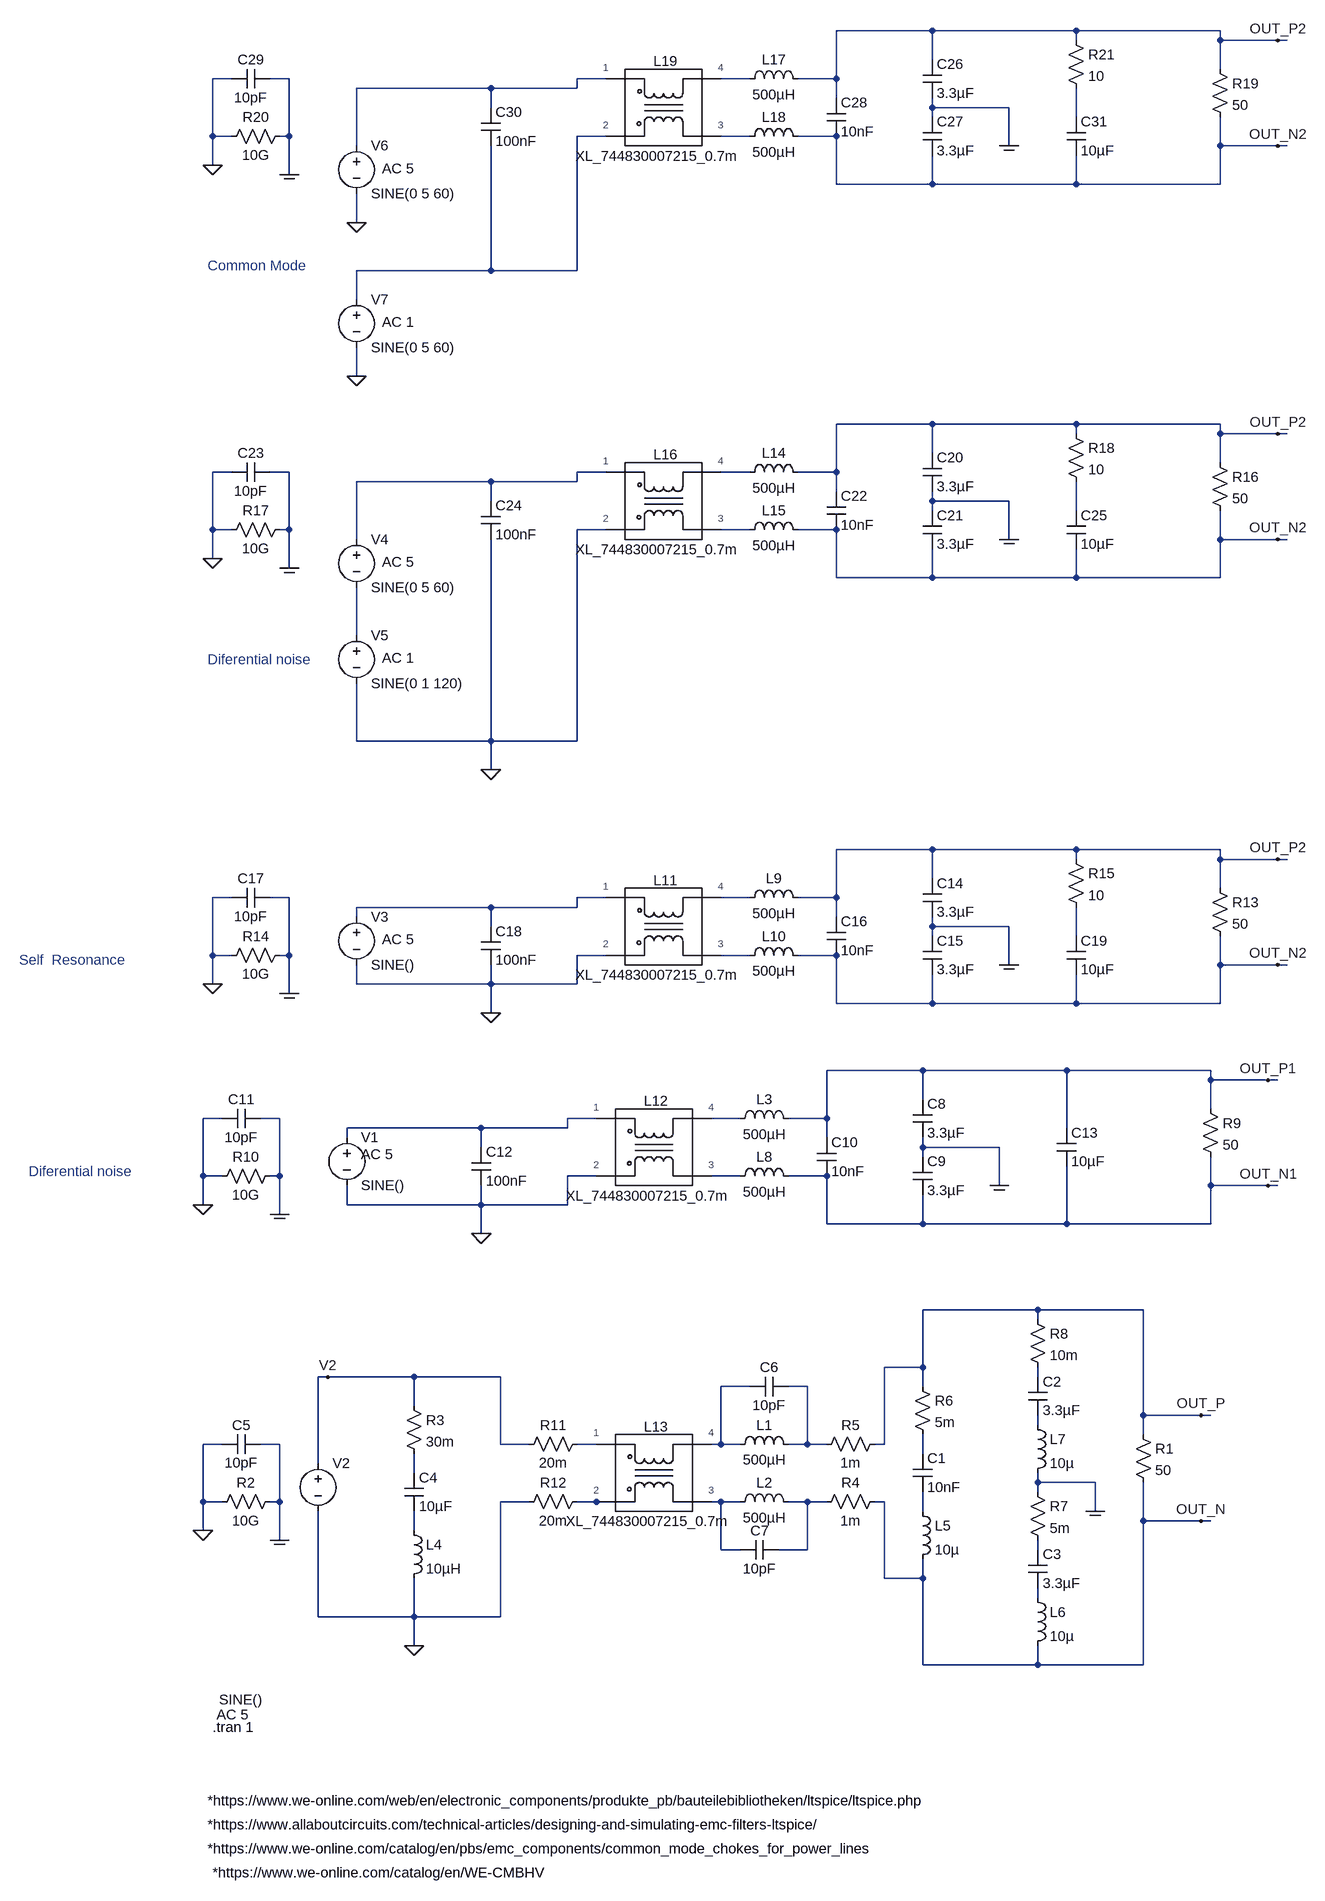
[diagram p0: schematic EMC-Filter_Cut.asc]
EMC-Filter_Cut.asc, the LTspice schematic file:
Version 4
SHEET 1 880 680
WIRE 240 -2928 80 -2928
WIRE 480 -2928 240 -2928
WIRE 720 -2928 480 -2928
WIRE 480 -2912 480 -2928
WIRE 720 -2912 720 -2928
WIRE 816 -2912 720 -2912
WIRE 832 -2912 816 -2912
WIRE 240 -2880 240 -2928
WIRE 720 -2864 720 -2912
WIRE -928 -2848 -960 -2848
WIRE -832 -2848 -864 -2848
WIRE -304 -2848 -352 -2848
WIRE -64 -2848 -112 -2848
WIRE 80 -2848 80 -2928
WIRE 80 -2848 16 -2848
WIRE -496 -2832 -720 -2832
WIRE -352 -2832 -352 -2848
WIRE -352 -2832 -496 -2832
WIRE 80 -2816 80 -2848
WIRE -496 -2800 -496 -2832
WIRE 240 -2800 240 -2816
WIRE 368 -2800 240 -2800
WIRE 240 -2784 240 -2800
WIRE 480 -2784 480 -2832
WIRE -960 -2752 -960 -2848
WIRE -928 -2752 -960 -2752
WIRE -832 -2752 -832 -2848
WIRE -832 -2752 -848 -2752
WIRE -304 -2752 -352 -2752
WIRE -64 -2752 -112 -2752
WIRE 80 -2752 16 -2752
WIRE -720 -2736 -720 -2832
WIRE 368 -2736 368 -2800
WIRE 720 -2736 720 -2784
WIRE 816 -2736 720 -2736
WIRE 832 -2736 816 -2736
WIRE -960 -2704 -960 -2752
WIRE -832 -2688 -832 -2752
WIRE 80 -2672 80 -2752
WIRE 240 -2672 240 -2720
WIRE 240 -2672 80 -2672
WIRE 480 -2672 480 -2720
WIRE 480 -2672 240 -2672
WIRE 720 -2672 720 -2736
WIRE 720 -2672 480 -2672
WIRE -720 -2608 -720 -2656
WIRE -496 -2528 -496 -2736
WIRE -496 -2528 -720 -2528
WIRE -352 -2528 -352 -2752
WIRE -352 -2528 -496 -2528
WIRE -720 -2480 -720 -2528
WIRE -720 -2352 -720 -2400
WIRE 240 -2272 80 -2272
WIRE 480 -2272 240 -2272
WIRE 720 -2272 480 -2272
WIRE 480 -2256 480 -2272
WIRE 720 -2256 720 -2272
WIRE 816 -2256 720 -2256
WIRE 832 -2256 816 -2256
WIRE 240 -2224 240 -2272
WIRE 720 -2208 720 -2256
WIRE -928 -2192 -960 -2192
WIRE -832 -2192 -864 -2192
WIRE -304 -2192 -352 -2192
WIRE -64 -2192 -112 -2192
WIRE 80 -2192 80 -2272
WIRE 80 -2192 16 -2192
WIRE -496 -2176 -720 -2176
WIRE -352 -2176 -352 -2192
WIRE -352 -2176 -496 -2176
WIRE 80 -2160 80 -2192
WIRE -496 -2144 -496 -2176
WIRE 240 -2144 240 -2160
WIRE 368 -2144 240 -2144
WIRE 240 -2128 240 -2144
WIRE 480 -2128 480 -2176
WIRE -960 -2096 -960 -2192
WIRE -928 -2096 -960 -2096
WIRE -832 -2096 -832 -2192
WIRE -832 -2096 -848 -2096
WIRE -304 -2096 -352 -2096
WIRE -64 -2096 -112 -2096
WIRE 80 -2096 16 -2096
WIRE -720 -2080 -720 -2176
WIRE 368 -2080 368 -2144
WIRE 720 -2080 720 -2128
WIRE 816 -2080 720 -2080
WIRE 832 -2080 816 -2080
WIRE -960 -2048 -960 -2096
WIRE -832 -2032 -832 -2096
WIRE 80 -2016 80 -2096
WIRE 240 -2016 240 -2064
WIRE 240 -2016 80 -2016
WIRE 480 -2016 480 -2064
WIRE 480 -2016 240 -2016
WIRE 720 -2016 720 -2080
WIRE 720 -2016 480 -2016
WIRE -720 -1920 -720 -2000
WIRE -720 -1744 -720 -1840
WIRE -496 -1744 -496 -2080
WIRE -496 -1744 -720 -1744
WIRE -352 -1744 -352 -2096
WIRE -352 -1744 -496 -1744
WIRE -496 -1696 -496 -1744
WIRE 240 -1536 80 -1536
WIRE 480 -1536 240 -1536
WIRE 720 -1536 480 -1536
WIRE 480 -1520 480 -1536
WIRE 720 -1520 720 -1536
WIRE 816 -1520 720 -1520
WIRE 832 -1520 816 -1520
WIRE 240 -1488 240 -1536
WIRE 720 -1472 720 -1520
WIRE -928 -1456 -960 -1456
WIRE -832 -1456 -864 -1456
WIRE -304 -1456 -352 -1456
WIRE -64 -1456 -112 -1456
WIRE 80 -1456 80 -1536
WIRE 80 -1456 16 -1456
WIRE -496 -1440 -720 -1440
WIRE -352 -1440 -352 -1456
WIRE -352 -1440 -496 -1440
WIRE -720 -1424 -720 -1440
WIRE 80 -1424 80 -1456
WIRE -496 -1408 -496 -1440
WIRE 240 -1408 240 -1424
WIRE 368 -1408 240 -1408
WIRE 240 -1392 240 -1408
WIRE 480 -1392 480 -1440
WIRE -960 -1360 -960 -1456
WIRE -928 -1360 -960 -1360
WIRE -832 -1360 -832 -1456
WIRE -832 -1360 -848 -1360
WIRE -304 -1360 -352 -1360
WIRE -64 -1360 -112 -1360
WIRE 80 -1360 16 -1360
WIRE 368 -1344 368 -1408
WIRE 720 -1344 720 -1392
WIRE 816 -1344 720 -1344
WIRE 832 -1344 816 -1344
WIRE -960 -1312 -960 -1360
WIRE -720 -1312 -720 -1344
WIRE -496 -1312 -496 -1344
WIRE -496 -1312 -720 -1312
WIRE -352 -1312 -352 -1360
WIRE -352 -1312 -496 -1312
WIRE -832 -1296 -832 -1360
WIRE 80 -1280 80 -1360
WIRE 240 -1280 240 -1328
WIRE 240 -1280 80 -1280
WIRE 480 -1280 480 -1328
WIRE 480 -1280 240 -1280
WIRE 720 -1280 720 -1344
WIRE 720 -1280 480 -1280
WIRE -496 -1264 -496 -1312
WIRE 224 -1168 64 -1168
WIRE 464 -1168 224 -1168
WIRE 704 -1168 464 -1168
WIRE 704 -1152 704 -1168
WIRE 800 -1152 704 -1152
WIRE 816 -1152 800 -1152
WIRE 224 -1120 224 -1168
WIRE 704 -1104 704 -1152
WIRE -944 -1088 -976 -1088
WIRE -848 -1088 -880 -1088
WIRE -320 -1088 -368 -1088
WIRE -80 -1088 -128 -1088
WIRE 64 -1088 64 -1168
WIRE 64 -1088 0 -1088
WIRE -512 -1072 -736 -1072
WIRE -368 -1072 -368 -1088
WIRE -368 -1072 -512 -1072
WIRE 464 -1072 464 -1168
WIRE -736 -1056 -736 -1072
WIRE 64 -1056 64 -1088
WIRE -512 -1040 -512 -1072
WIRE 224 -1040 224 -1056
WIRE 352 -1040 224 -1040
WIRE 224 -1024 224 -1040
WIRE -976 -992 -976 -1088
WIRE -944 -992 -976 -992
WIRE -848 -992 -848 -1088
WIRE -848 -992 -864 -992
WIRE -320 -992 -368 -992
WIRE -80 -992 -128 -992
WIRE 64 -992 0 -992
WIRE 352 -976 352 -1040
WIRE 704 -976 704 -1024
WIRE 800 -976 704 -976
WIRE 816 -976 800 -976
WIRE -976 -944 -976 -992
WIRE -736 -944 -736 -976
WIRE -512 -944 -512 -976
WIRE -512 -944 -736 -944
WIRE -368 -944 -368 -992
WIRE -368 -944 -512 -944
WIRE -848 -928 -848 -992
WIRE 64 -912 64 -992
WIRE 224 -912 224 -960
WIRE 224 -912 64 -912
WIRE 464 -912 464 -1008
WIRE 464 -912 224 -912
WIRE 704 -912 704 -976
WIRE 704 -912 464 -912
WIRE -512 -896 -512 -944
WIRE 416 -544 224 -544
WIRE 592 -544 416 -544
WIRE 416 -528 416 -544
WIRE 224 -448 224 -544
WIRE 224 -448 160 -448
WIRE -768 -432 -784 -432
WIRE -624 -432 -768 -432
WIRE -480 -432 -624 -432
WIRE 416 -432 416 -448
WIRE -64 -416 -112 -416
WIRE 32 -416 0 -416
WIRE 224 -416 224 -448
WIRE -624 -384 -624 -432
WIRE 592 -368 592 -544
WIRE 688 -368 592 -368
WIRE 704 -368 688 -368
WIRE 416 -352 416 -368
WIRE 592 -336 592 -368
WIRE -944 -320 -976 -320
WIRE -848 -320 -880 -320
WIRE -480 -320 -480 -432
WIRE -432 -320 -480 -320
WIRE -320 -320 -352 -320
WIRE -112 -320 -112 -416
WIRE -112 -320 -128 -320
WIRE -80 -320 -112 -320
WIRE 32 -320 32 -416
WIRE 32 -320 0 -320
WIRE 64 -320 32 -320
WIRE 160 -320 160 -448
WIRE 160 -320 144 -320
WIRE 224 -304 224 -336
WIRE -784 -288 -784 -432
WIRE -624 -272 -624 -304
WIRE 416 -256 416 -272
WIRE 512 -256 416 -256
WIRE 416 -240 416 -256
WIRE -976 -224 -976 -320
WIRE -944 -224 -976 -224
WIRE -848 -224 -848 -320
WIRE -848 -224 -864 -224
WIRE -432 -224 -480 -224
WIRE -320 -224 -352 -224
WIRE -304 -224 -320 -224
WIRE -112 -224 -128 -224
WIRE -80 -224 -112 -224
WIRE 32 -224 0 -224
WIRE 64 -224 32 -224
WIRE 160 -224 144 -224
WIRE 224 -208 224 -240
WIRE 512 -208 512 -256
WIRE 592 -192 592 -256
WIRE 688 -192 592 -192
WIRE 704 -192 688 -192
WIRE -976 -176 -976 -224
WIRE -624 -176 -624 -208
WIRE -848 -160 -848 -224
WIRE -112 -144 -112 -224
WIRE -80 -144 -112 -144
WIRE 32 -144 32 -224
WIRE 32 -144 -16 -144
WIRE 416 -144 416 -160
WIRE 160 -96 160 -224
WIRE 224 -96 224 -128
WIRE 224 -96 160 -96
WIRE 416 -64 416 -80
WIRE -784 -32 -784 -208
WIRE -624 -32 -624 -96
WIRE -624 -32 -784 -32
WIRE -480 -32 -480 -224
WIRE -480 -32 -624 -32
WIRE -624 16 -624 -32
WIRE 224 48 224 -96
WIRE 416 48 416 16
WIRE 416 48 224 48
WIRE 592 48 592 -192
WIRE 592 48 416 48
FLAG -624 16 0
FLAG 688 -368 OUT_P
FLAG 688 -192 OUT_N
FLAG -768 -432 V2
FLAG -976 -176 0
FLAG -848 -160 COM
FLAG 512 -208 COM
FLAG -512 -896 0
FLAG 800 -1152 OUT_P1
FLAG 800 -976 OUT_N1
FLAG -976 -944 0
FLAG -848 -928 COM
FLAG 352 -976 COM
FLAG -496 -1264 0
FLAG 816 -1520 OUT_P2
FLAG 816 -1344 OUT_N2
FLAG -960 -1312 0
FLAG -832 -1296 COM
FLAG 368 -1344 COM
FLAG -496 -1696 0
FLAG 816 -2256 OUT_P2
FLAG 816 -2080 OUT_N2
FLAG -960 -2048 0
FLAG -832 -2032 COM
FLAG 368 -2080 COM
FLAG -720 -2352 0
FLAG 816 -2912 OUT_P2
FLAG 816 -2736 OUT_N2
FLAG -960 -2704 0
FLAG -832 -2688 COM
FLAG 368 -2736 COM
FLAG -720 -2608 0
SYMBOL cap 400 -432 R0
SYMATTR InstName C2
SYMATTR Value 3.3µF
SYMBOL cap 400 -144 R0
SYMATTR InstName C3
SYMATTR Value 3.3µF
SYMBOL voltage -784 -304 R0
WINDOW 3 -165 410 Left 2
WINDOW 123 -169 435 Left 2
WINDOW 39 0 0 Left 0
SYMATTR Value SINE()
SYMATTR Value2 AC 5
SYMATTR InstName V2
SYMBOL res 576 -352 R0
SYMATTR InstName R1
SYMATTR Value 50
SYMBOL cap 208 -304 R0
SYMATTR InstName C1
SYMATTR Value 10nF
SYMBOL res -848 -240 R90
WINDOW 0 0 56 VBottom 2
WINDOW 3 32 56 VTop 2
SYMATTR InstName R2
SYMATTR Value 10G
SYMBOL cap -880 -336 R90
WINDOW 0 0 32 VBottom 2
WINDOW 3 32 32 VTop 2
SYMATTR InstName C5
SYMATTR Value 10pF
SYMBOL cap -640 -272 R0
SYMATTR InstName C4
SYMATTR Value 10µF
SYMBOL ind -96 -304 R270
WINDOW 0 32 56 VTop 2
WINDOW 3 5 56 VBottom 2
SYMATTR InstName L1
SYMATTR Value 500µH
SYMBOL ind -96 -208 R270
WINDOW 0 32 56 VTop 2
WINDOW 3 5 56 VBottom 2
SYMATTR InstName L2
SYMATTR Value 500µH
SYMBOL res -640 -400 R0
SYMATTR InstName R3
SYMATTR Value 30m
SYMBOL ind -640 -192 R0
SYMATTR InstName L4
SYMATTR Value 10µH
SYMBOL res 160 -240 R90
WINDOW 0 0 56 VBottom 2
WINDOW 3 32 56 VTop 2
SYMATTR InstName R4
SYMATTR Value 1m
SYMBOL res 160 -336 R90
WINDOW 0 0 56 VBottom 2
WINDOW 3 32 56 VTop 2
SYMATTR InstName R5
SYMATTR Value 1m
SYMBOL cap 0 -432 R90
WINDOW 0 0 32 VBottom 2
WINDOW 3 32 32 VTop 2
SYMATTR InstName C6
SYMATTR Value 10pF
SYMBOL cap -16 -160 R90
WINDOW 0 0 32 VBottom 2
WINDOW 3 32 32 VTop 2
SYMATTR InstName C7
SYMATTR Value 10pF
SYMBOL res 208 -432 R0
SYMATTR InstName R6
SYMATTR Value 5m
SYMBOL ind 208 -224 R0
SYMATTR InstName L5
SYMATTR Value 10µ
SYMBOL res 400 -256 R0
SYMATTR InstName R7
SYMATTR Value 5m
SYMBOL ind 400 -80 R0
SYMATTR InstName L6
SYMATTR Value 10µ
SYMBOL ind 400 -368 R0
SYMATTR InstName L7
SYMATTR Value 10µ
SYMBOL res 400 -544 R0
SYMATTR InstName R8
SYMATTR Value 10m
SYMBOL cap 208 -1120 R0
SYMATTR InstName C8
SYMATTR Value 3.3µF
SYMBOL cap 208 -1024 R0
SYMATTR InstName C9
SYMATTR Value 3.3µF
SYMBOL res 688 -1120 R0
SYMATTR InstName R9
SYMATTR Value 50
SYMBOL cap 48 -1056 R0
SYMATTR InstName C10
SYMATTR Value 10nF
SYMBOL res -848 -1008 R90
WINDOW 0 0 56 VBottom 2
WINDOW 3 32 56 VTop 2
SYMATTR InstName R10
SYMATTR Value 10G
SYMBOL cap -880 -1104 R90
WINDOW 0 0 32 VBottom 2
WINDOW 3 32 32 VTop 2
SYMATTR InstName C11
SYMATTR Value 10pF
SYMBOL cap -528 -1040 R0
SYMATTR InstName C12
SYMATTR Value 100nF
SYMBOL ind -96 -1072 R270
WINDOW 0 32 56 VTop 2
WINDOW 3 5 56 VBottom 2
SYMATTR InstName L3
SYMATTR Value 500µH
SYMBOL ind -96 -976 R270
WINDOW 0 32 56 VTop 2
WINDOW 3 5 56 VBottom 2
SYMATTR InstName L8
SYMATTR Value 500µH
SYMBOL voltage -736 -1072 R0
WINDOW 123 24 44 Left 2
WINDOW 39 0 0 Left 0
SYMATTR Value2 AC 5
SYMATTR InstName V1
SYMATTR Value SINE()
SYMBOL res -336 -336 R90
WINDOW 0 0 56 VBottom 2
WINDOW 3 32 56 VTop 2
SYMATTR InstName R11
SYMATTR Value 20m
SYMBOL res -336 -240 R90
WINDOW 0 0 56 VBottom 2
WINDOW 3 32 56 VTop 2
SYMATTR InstName R12
SYMATTR Value 20m
SYMBOL cap 448 -1072 R0
SYMATTR InstName C13
SYMATTR Value 10µF
SYMBOL cap 224 -1488 R0
SYMATTR InstName C14
SYMATTR Value 3.3µF
SYMBOL cap 224 -1392 R0
SYMATTR InstName C15
SYMATTR Value 3.3µF
SYMBOL res 704 -1488 R0
SYMATTR InstName R13
SYMATTR Value 50
SYMBOL cap 64 -1424 R0
SYMATTR InstName C16
SYMATTR Value 10nF
SYMBOL res -832 -1376 R90
WINDOW 0 0 56 VBottom 2
WINDOW 3 32 56 VTop 2
SYMATTR InstName R14
SYMATTR Value 10G
SYMBOL cap -864 -1472 R90
WINDOW 0 0 32 VBottom 2
WINDOW 3 32 32 VTop 2
SYMATTR InstName C17
SYMATTR Value 10pF
SYMBOL cap -512 -1408 R0
SYMATTR InstName C18
SYMATTR Value 100nF
SYMBOL ind -80 -1440 R270
WINDOW 0 32 56 VTop 2
WINDOW 3 5 56 VBottom 2
SYMATTR InstName L9
SYMATTR Value 500µH
SYMBOL ind -80 -1344 R270
WINDOW 0 32 56 VTop 2
WINDOW 3 5 56 VBottom 2
SYMATTR InstName L10
SYMATTR Value 500µH
SYMBOL voltage -720 -1440 R0
WINDOW 123 43 54 Left 2
WINDOW 39 0 0 Left 0
SYMATTR Value2 AC 5
SYMATTR InstName V3
SYMATTR Value SINE()
SYMBOL cap 464 -1392 R0
SYMATTR InstName C19
SYMATTR Value 10µF
SYMBOL res 464 -1536 R0
SYMATTR InstName R15
SYMATTR Value 10
SYMBOL MyFiles\\WE-CMBHV -208 -1408 R0
SYMATTR InstName L11
SYMBOL MyFiles\\WE-CMBHV -224 -1040 R0
SYMATTR InstName L12
SYMBOL MyFiles\\WE-CMBHV -224 -272 R0
SYMATTR InstName L13
SYMBOL cap 224 -2224 R0
SYMATTR InstName C20
SYMATTR Value 3.3µF
SYMBOL cap 224 -2128 R0
SYMATTR InstName C21
SYMATTR Value 3.3µF
SYMBOL res 704 -2224 R0
SYMATTR InstName R16
SYMATTR Value 50
SYMBOL cap 64 -2160 R0
SYMATTR InstName C22
SYMATTR Value 10nF
SYMBOL res -832 -2112 R90
WINDOW 0 0 56 VBottom 2
WINDOW 3 32 56 VTop 2
SYMATTR InstName R17
SYMATTR Value 10G
SYMBOL cap -864 -2208 R90
WINDOW 0 0 32 VBottom 2
WINDOW 3 32 32 VTop 2
SYMATTR InstName C23
SYMATTR Value 10pF
SYMBOL cap -512 -2144 R0
SYMATTR InstName C24
SYMATTR Value 100nF
SYMBOL ind -80 -2176 R270
WINDOW 0 32 56 VTop 2
WINDOW 3 5 56 VBottom 2
SYMATTR InstName L14
SYMATTR Value 500µH
SYMBOL ind -80 -2080 R270
WINDOW 0 32 56 VTop 2
WINDOW 3 5 56 VBottom 2
SYMATTR InstName L15
SYMATTR Value 500µH
SYMBOL voltage -720 -2096 R0
WINDOW 123 43 54 Left 2
WINDOW 39 0 0 Left 0
SYMATTR Value2 AC 5
SYMATTR InstName V4
SYMATTR Value SINE(0 5 60)
SYMBOL cap 464 -2128 R0
SYMATTR InstName C25
SYMATTR Value 10µF
SYMBOL res 464 -2272 R0
SYMATTR InstName R18
SYMATTR Value 10
SYMBOL MyFiles\\WE-CMBHV -208 -2144 R0
SYMATTR InstName L16
SYMBOL voltage -720 -1936 R0
WINDOW 123 43 54 Left 2
WINDOW 39 0 0 Left 0
SYMATTR Value2 AC 1
SYMATTR InstName V5
SYMATTR Value SINE(0 1 120)
SYMBOL cap 224 -2880 R0
SYMATTR InstName C26
SYMATTR Value 3.3µF
SYMBOL cap 224 -2784 R0
SYMATTR InstName C27
SYMATTR Value 3.3µF
SYMBOL res 704 -2880 R0
SYMATTR InstName R19
SYMATTR Value 50
SYMBOL cap 64 -2816 R0
SYMATTR InstName C28
SYMATTR Value 10nF
SYMBOL res -832 -2768 R90
WINDOW 0 0 56 VBottom 2
WINDOW 3 32 56 VTop 2
SYMATTR InstName R20
SYMATTR Value 10G
SYMBOL cap -864 -2864 R90
WINDOW 0 0 32 VBottom 2
WINDOW 3 32 32 VTop 2
SYMATTR InstName C29
SYMATTR Value 10pF
SYMBOL cap -512 -2800 R0
SYMATTR InstName C30
SYMATTR Value 100nF
SYMBOL ind -80 -2832 R270
WINDOW 0 32 56 VTop 2
WINDOW 3 5 56 VBottom 2
SYMATTR InstName L17
SYMATTR Value 500µH
SYMBOL ind -80 -2736 R270
WINDOW 0 32 56 VTop 2
WINDOW 3 5 56 VBottom 2
SYMATTR InstName L18
SYMATTR Value 500µH
SYMBOL voltage -720 -2752 R0
WINDOW 123 43 54 Left 2
WINDOW 39 0 0 Left 0
SYMATTR Value2 AC 5
SYMATTR InstName V6
SYMATTR Value SINE(0 5 60)
SYMBOL cap 464 -2784 R0
SYMATTR InstName C31
SYMATTR Value 10µF
SYMBOL res 464 -2928 R0
SYMATTR InstName R21
SYMATTR Value 10
SYMBOL MyFiles\\WE-CMBHV -208 -2800 R0
SYMATTR InstName L19
SYMBOL voltage -720 -2496 R0
WINDOW 123 43 54 Left 2
WINDOW 39 0 0 Left 0
SYMATTR Value2 AC 1
SYMATTR InstName V7
SYMATTR Value SINE(0 5 60)
TEXT -960 152 Left 2 !.tran 1
TEXT -968 296 Left 2 !*https://www.we-online.com/web/en/electronic_components/produkte_pb/bauteilebibliotheken/ltspice/ltspice.php
TEXT -968 336 Left 2 !*https://www.allaboutcircuits.com/technical-articles/designing-and-simulating-emc-filters-ltspice/
TEXT -968 376 Left 2 !*https://www.we-online.com/catalog/en/pbs/emc_components/common_mode_chokes_for_power_lines
TEXT -960 416 Left 2 !*https://www.we-online.com/catalog/en/WE-CMBHV
TEXT -968 -1880 Left 2 ;Diferential noise
TEXT -968 -2536 Left 2 ;Common Mode
TEXT -1288 -1000 Left 2 ;Diferential noise
TEXT -1304 -1352 Left 2 ;Self  Resonance

The netlist it stands for:
* EMC-Filter_Cut.asc
C2 N018 N021 3.3µF
C3 N030 N031 3.3µF
V2 V2 0 SINE() AC 5
R1 OUT_P OUT_N 50
C1 N023 N028 10nF
R2 COM 0 10G
C5 COM 0 10pF
C4 N024 N029 10µF
L1 N019 N020 500µH
L2 N026 N027 500µH
R3 V2 N024 30m
L4 N029 0 10µH
R4 OUT_N N027 1m
R5 OUT_P N020 1m
C6 N020 N019 10pF
C7 N027 N026 10pF
R6 OUT_P N023 5m
L5 N028 OUT_N 10µ
R7 COM N030 5m
L6 N031 OUT_N 10µ
L7 N021 COM 10µ
R8 OUT_P N018 10m
C8 OUT_P1 COM 3.3µF
C9 COM OUT_N1 3.3µF
R9 OUT_P1 OUT_N1 50
C10 OUT_P1 OUT_N1 10nF
R10 COM 0 10G
C11 COM 0 10pF
C12 N015 0 100nF
L3 N016 OUT_P1 500µH
L8 N017 OUT_N1 500µH
V1 N015 0 SINE() AC 5
R11 N022 V2 20m
R12 N025 0 20m
C13 OUT_P1 OUT_N1 10µF
C14 OUT_P2 COM 3.3µF
C15 COM OUT_N2 3.3µF
R13 OUT_P2 OUT_N2 50
C16 OUT_P2 OUT_N2 10nF
R14 COM 0 10G
C17 COM 0 10pF
C18 N011 0 100nF
L9 N012 OUT_P2 500µH
L10 N014 OUT_N2 500µH
V3 N011 0 SINE() AC 5
C19 N013 OUT_N2 10µF
R15 OUT_P2 N013 10
XL11 N011 0 N014 N012 XL_744830007215_0.7m  ; pins 1 2 3 4
XL12 N015 0 N017 N016 XL_744830007215_0.7m  ; pins 1 2 3 4
XL13 N022 N025 N026 N019 XL_744830007215_0.7m  ; pins 1 2 3 4
C20 OUT_P2 COM 3.3µF
C21 COM OUT_N2 3.3µF
R16 OUT_P2 OUT_N2 50
C22 OUT_P2 OUT_N2 10nF
R17 COM 0 10G
C23 COM 0 10pF
C24 N006 0 100nF
L14 N007 OUT_P2 500µH
L15 N009 OUT_N2 500µH
V4 N006 N010 SINE(0 5 60) AC 5
C25 N008 OUT_N2 10µF
R18 OUT_P2 N008 10
XL16 N006 0 N009 N007 XL_744830007215_0.7m  ; pins 1 2 3 4
V5 N010 0 SINE(0 1 120) AC 1
C26 OUT_P2 COM 3.3µF
C27 COM OUT_N2 3.3µF
R19 OUT_P2 OUT_N2 50
C28 OUT_P2 OUT_N2 10nF
R20 COM 0 10G
C29 COM 0 10pF
C30 N001 N004 100nF
L17 N002 OUT_P2 500µH
L18 N005 OUT_N2 500µH
V6 N001 0 SINE(0 5 60) AC 5
C31 N003 OUT_N2 10µF
R21 OUT_P2 N003 10
XL19 N001 N004 N005 N002 XL_744830007215_0.7m  ; pins 1 2 3 4
V7 N004 0 SINE(0 5 60) AC 1
.tran 1
*https://www.we-online.com/web/en/electronic_components/produkte_pb/bauteilebibliotheken/ltspice/ltspice.php
*https://www.allaboutcircuits.com/technical-articles/designing-and-simulating-emc-filters-ltspice/
*https://www.we-online.com/catalog/en/pbs/emc_components/common_mode_chokes_for_power_lines
*https://www.we-online.com/catalog/en/WE-CMBHV
* Diferential noise
* Common Mode
* Diferential noise
* Self  Resonance
.lib WE-CMBHV.lib
.backanno
.end